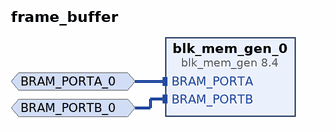
[diagram p0: block diagram of the top level]
# Vivado block design frame_buffer, xc7z020clg400-1, Vivado 2022.2
create_bd_design frame_buffer

create_bd_intf_port -mode Slave -vlnv xilinx.com:interface:bram_rtl:1.0 BRAM_PORTA_0
set_property -dict {CONFIG.READ_WRITE_MODE WRITE_ONLY} [get_bd_intf_ports BRAM_PORTA_0]
create_bd_intf_port -mode Slave -vlnv xilinx.com:interface:bram_rtl:1.0 BRAM_PORTB_0
set_property -dict {CONFIG.READ_WRITE_MODE READ_ONLY} [get_bd_intf_ports BRAM_PORTB_0]

create_bd_cell -type ip -vlnv xilinx.com:ip:blk_mem_gen:8.4 blk_mem_gen_0
set_property -dict [list \
  CONFIG.Algorithm Minimum_Area \
  CONFIG.Byte_Size 8 \
  CONFIG.Disable_Collision_Warnings false \
  CONFIG.Disable_Out_of_Range_Warnings false \
  CONFIG.Enable_32bit_Address false \
  CONFIG.Memory_Type Simple_Dual_Port_RAM \
  CONFIG.Use_Byte_Write_Enable true \
  CONFIG.Write_Depth_A 19200 \
  CONFIG.Write_Width_A 128 \
  CONFIG.Write_Width_B 128 \
  CONFIG.use_bram_block Stand_Alone \
] [get_bd_cells blk_mem_gen_0]

# ---- connections ----

connect_bd_intf_net -intf_net BRAM_PORTA_0_1 [get_bd_intf_ports BRAM_PORTA_0] [get_bd_intf_pins blk_mem_gen_0/BRAM_PORTA]
connect_bd_intf_net -intf_net BRAM_PORTB_0_1 [get_bd_intf_ports BRAM_PORTB_0] [get_bd_intf_pins blk_mem_gen_0/BRAM_PORTB]

validate_bd_design
save_bd_design
